# EAGLE design main (EAGLE 9.1.3)
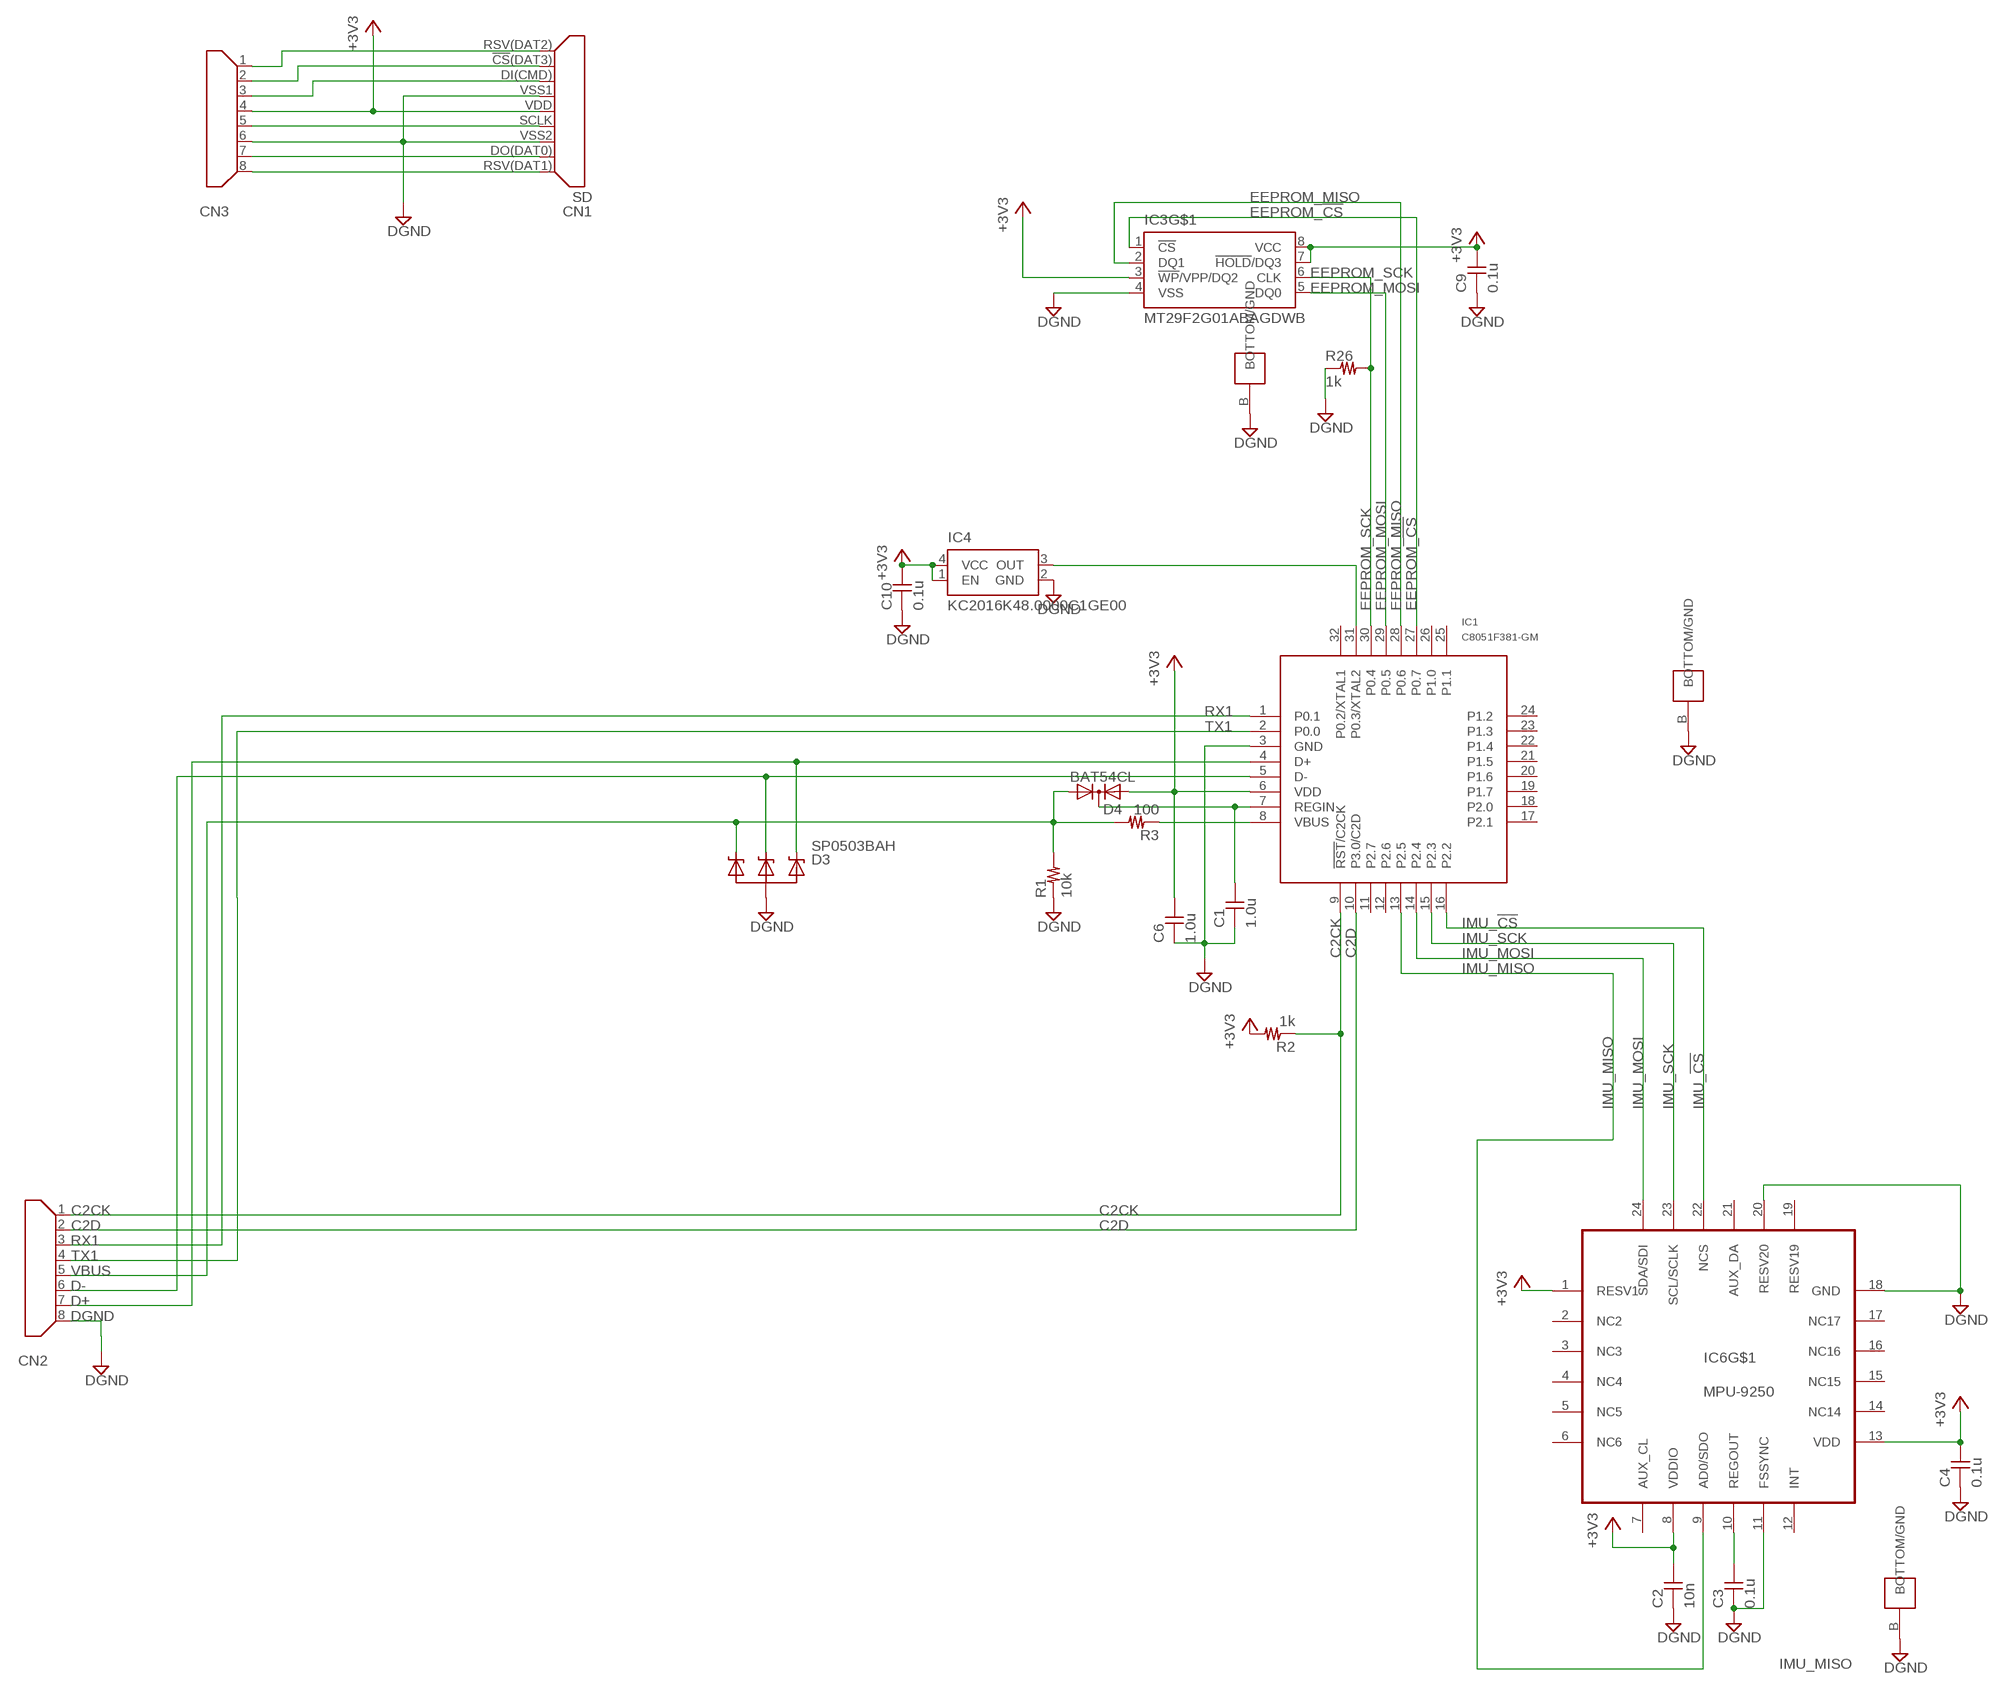
[diagram p0: schematic, sheet 1]

## Parts
C1  1.0u  C-1005  [1005]
C2  10n  C-1005  [1005]
C3  0.1u  C-1005  [1005]
C4  0.1u  C-1005  [1005]
C6  1.0u  C-1005  [1005]
C9  0.1u  C-1005  [1005]
C10  0.1u  C-1005  [1005]
CN1  SD  [SD_V3]
CN2  MICROSD  [BLOCK_SD_CONNECTOR]
CN3  MICROSD  [BLOCK_SD_CONNECTOR]
D3  SP0503BAH  [SOT143]
D4  BAT54CL  HSMS-2854  [SOT23]
IC1  C8051F381-GM  [QFN32]
IC3  MT29F2G01ABAGDWB  N25Q512A  [V-PDFN-8]
IC4  KC2016K48.0000C1GE00  KC2016K  [KC2016K]
IC6  MPU-9250  [QFN-24]
R1  10k  R-1005  [1005]
R2  1k  R-1005  [1005]
R3  100  R-1005  [1005]
R26  1k  R-1005  [1005]

## Nets
+3V3 [power]: C2.P$2 C4.P$2 C6.P$2 C9.P$2 C10.P$2 CN1.VDD CN3.4 D4.2(A2) IC1.6(VDD) IC3.3(!WP!/VPP/DQ2) IC3.7(!HOLD!/DQ3) IC3.8(VCC) IC4.1(EN) IC4.4(VCC) IC6.1(RESV1) IC6.8(VDDIO) IC6.13(VDD) R2.P$2
C2CK: CN2.1 IC1.9(!RST!/C2CK) R2.P$1
C2D: CN2.2 IC1.10(P3.0/C2D)
D+: CN2.7 D3.2 IC1.4(D+)
D-: CN2.6 D3.3 IC1.5(D-)
DGND [power]: C1.P$1 C2.P$1 C3.P$1 C4.P$1 C6.P$1 C9.P$1 C10.P$1 CN1.VSS1 CN1.VSS2 CN2.8 CN3.6 D3.1 IC1.3(GND) IC1.B(BOTTOM/GND) IC3.4(VSS) IC3.B(BOTTOM/GND) IC4.2(GND) IC6.11(FSSYNC) IC6.18(GND) IC6.20(RESV20) IC6.B(BOTTOM/GND) R1.P$1 R26.P$1
EEPROM_!CS: IC1.27(P0.7) IC3.1(!CS)
EEPROM_MISO: IC1.28(P0.6) IC3.2(DQ1)
EEPROM_MOSI: IC1.29(P0.5) IC3.5(DQ0)
EEPROM_SCK: IC1.30(P0.4) IC3.6(CLK) R26.P$2
IMU_!CS: IC1.16(P2.2) IC6.22(NCS)
IMU_MISO: IC1.13(P2.5) IC6.9(AD0/SDO)
IMU_MOSI: IC1.14(P2.4) IC6.24(SDA/SDI)
IMU_SCK: IC1.15(P2.3) IC6.23(SCL/SCLK)
N$1 [power]: C1.P$2 D4.3(C) IC1.7(REGIN)
N$2: CN1.RSV(DAT1) CN3.8
N$3: CN1.DO(DAT0) CN3.7
N$4: IC1.8(VBUS) R3.P$1
N$6: CN1.SCLK CN3.5
N$10: CN1.DI(CMD) CN3.3
N$11: IC1.31(P0.3/XTAL2) IC4.3(OUT)
N$12: CN1.!CS!(DAT3) CN3.2
N$13: C3.P$2 IC6.10(REGOUT)
N$14: CN1.RSV(DAT2) CN3.1
RX1: CN2.3 IC1.1(P0.1)
TX1: CN2.4 IC1.2(P0.0)
VBUS [power]: CN2.5 D3.4 D4.1(A1) R1.P$2 R3.P$2
Unconnected: IC1.11(P2.7) IC1.12(P2.6) IC1.17(P2.1) IC1.18(P2.0) IC1.19(P1.7) IC1.20(P1.6) IC1.21(P1.5) IC1.22(P1.4) IC1.23(P1.3) IC1.24(P1.2) IC1.25(P1.1) IC1.26(P1.0) IC1.32(P0.2/XTAL1) IC6.2(NC2) IC6.3(NC3) IC6.4(NC4) IC6.5(NC5) IC6.6(NC6) IC6.7(AUX_CL) IC6.12(INT) IC6.14(NC14) IC6.15(NC15) IC6.16(NC16) IC6.17(NC17) IC6.19(RESV19) IC6.21(AUX_DA)

## Library data of the parts
C1-C4 C6 C9 C10 = reg,cap:C-
CN1 = Connector:SD
CN2 CN3 = Connector:MICROSD
D3 = diode:SP0503BAH
D4 = avago:HSMS-2854: Surface Mount Microwave Schottky Detector Diodes Source: Data sheet <http://www.farnell.com/datasheets/461166.pdf>
IC1 = C8051F34x:C8051F381-GM
IC3 = EEPROM:N25Q512A
IC4 = Oscillator:KC2016K
IC6 = GYRO:MPU-9250
R1-R3 R26 = reg,cap:R-

## Net classes
0 signal: width 0.152 mm
1 power: width 0.203 mm

## Board
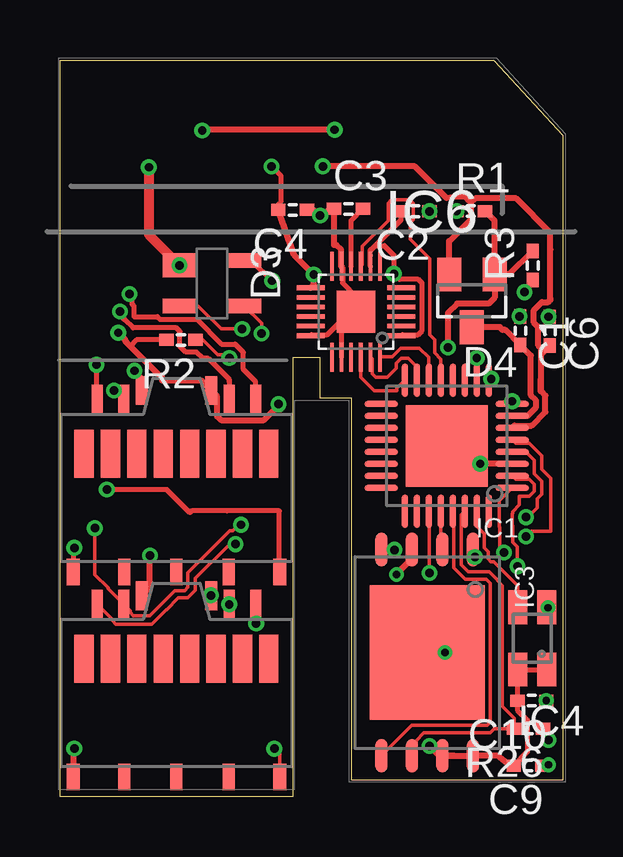
[diagram p1: board, top side]
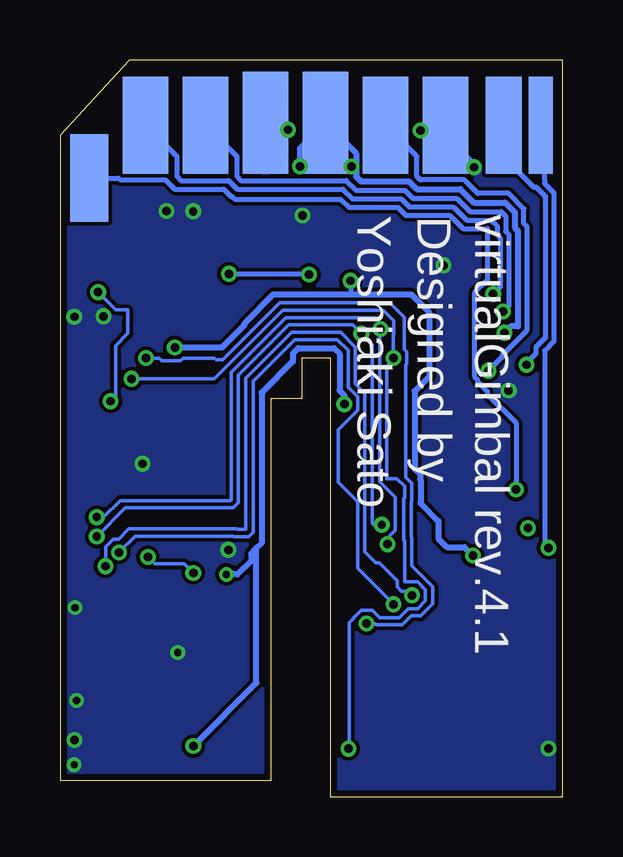
[diagram p2: board, bottom side, seen from below]

Size 20.95 x 30.7 mm. Coordinates in mm from the lower left corner, seen from the top.
Outline: 0,0 0,23.55 0,30.7 18.07,30.7 20.95,27.57 20.95,23.55 20.95,0.7 12.15,0.7 12.15,16.6 10.85,16.6 10.85,18.3 9.7,18.3 9.7,0 0,0
Copper layers (1*16): Top 0.035mm / dielectric 1.5mm / Bottom 0.035mm
Design rules "SeeedStudio_2layer_DRU_no_angle_20140221": minimum track width 6mil, minimum drill 12mil, track to track 6mil, track to pad 6mil, pad to pad 6mil, via to via 6mil, smd to smd 0mil, copper to edge 10mil, drill to drill 10mil, minimum pad ring 10mil, minimum via ring 6mil, stop-mask expansion 2mil, vias tented up to drill 100mil, thermal gap 10mil

### Footprints (pad centres in the part's own frame; a part is rotated, then mirrored left to right if it is on the bottom)
1005 = smd 0.6 x 0.5: P$1 -0.6,0; P$2 0.6,0
SD_V3 = smd 1.9 x 4.05: !CS!(DAT3) 2.5,2.2; DI(CMD) 5,2.2; SCLK 12.5,2.2; VSS2 15,2.2 | smd 1.5 x 4.05: DO(DAT0) 17.42,2.2 | smd 1 x 4.05: RSV(DAT1) 18.97,2.2 | smd 1.6 x 3.65: RSV(DAT2) 0.15,0 | smd 1.9 x 4.25: VDD 10,2.3; VSS1 7.5,2.3
BLOCK_SD_CONNECTOR = smd 0.55 x 1.1: 1 4.3,-0.43; 8 -4.3,-0.43 | smd 0.45 x 1.2: 2 3.3,6.77; 3 2.2,6.77; 6 -2.2,6.77; 7 -3.3,6.77 | smd 0.5 x 1.2: 4 1.45,7.13; 5 -1.45,7.13 | smd 0.5 x 1.1: 9 -2.18,-0.43; 10 0,-0.43; 11 2.18,-0.43 | smd 0.8 x 2: 12 -3.85,4.5; 13 -2.75,4.5; 14 -1.65,4.5; 15 -0.55,4.5; 16 0.55,4.5; 17 1.65,4.5; 18 2.75,4.5; 19 3.85,4.5
SOT143 = smd 1 x 1.4: 1 -0.75,-1.35 | smd 0.6 x 1.4: 2 0.95,-1.35; 3 0.95,1.35; 4 -0.95,1.35
SOT23 = smd 1 x 1.4: 1 -0.95,-1.1; 2 0.95,-1.1; 3 0,1.1
QFN32 = smd 1.4 x 0.25: 1 -2.725,1.75; 2 -2.725,1.25; 3 -2.725,0.75; 4 -2.725,0.25; 5 -2.725,-0.25; 6 -2.725,-0.75; 7 -2.725,-1.25; 8 -2.725,-1.75; 17 2.725,-1.75; 18 2.725,-1.25; 19 2.725,-0.75; 20 2.725,-0.25; 21 2.725,0.25; 22 2.725,0.75; 23 2.725,1.25; 24 2.725,1.75 | smd 0.25 x 1.4: 9 -1.75,-2.725; 10 -1.25,-2.725; 11 -0.75,-2.725; 12 -0.25,-2.725; 13 0.25,-2.725; 14 0.75,-2.725; 15 1.25,-2.725; 16 1.75,-2.725; 25 1.75,2.725; 26 1.25,2.725; 27 0.75,2.725; 28 0.25,2.725; 29 -0.25,2.725; 30 -0.75,2.725; 31 -1.25,2.725; 32 -1.75,2.725 | smd 3.4 x 3.4: B 0,0
V-PDFN-8 = smd 1.4 x 0.5: 1 -4.3,1.905; 2 -4.3,0.635; 3 -4.3,-0.635; 4 -4.3,-1.905; 5 4.3,-1.905; 6 4.3,-0.635; 7 4.3,0.635; 8 4.3,1.905 | smd 5.6 x 4.8: B 0,0
KC2016K = smd 1.4 x 0.8: 1 -1.3,-0.6; 2 1.3,-0.6; 3 1.3,0.6; 4 -1.3,0.6
QFN-24 = smd 1.22 x 0.2: 1 -1.89,1; 2 -1.89,0.6; 3 -1.89,0.2; 4 -1.89,-0.2; 5 -1.89,-0.6; 6 -1.89,-1; 13 1.89,-1; 14 1.89,-0.6; 15 1.89,-0.2; 16 1.89,0.2; 17 1.89,0.6; 18 1.89,1 | smd 0.2 x 1.22: 7 -1,-1.89; 8 -0.6,-1.89; 9 -0.2,-1.89; 10 0.2,-1.89; 11 0.6,-1.89; 12 1,-1.89; 19 1,1.89; 20 0.6,1.89; 21 0.2,1.89; 22 -0.2,1.89; 23 -0.6,1.89; 24 -1,1.89 | smd 1.59 x 1.75: B 0,0

### Placement (x,y rotation side)
C1  19.18,19.42 270 top
C2  14.8,24.39 180 top
C3  12.02,24.5 0 top
C4  9.69,24.46 180 top
C6  20.41,19.4 270 top
C9  19.5,1.3 180 top
C10  19.66,4.01 180 top
CN1  19.88,25.78 0 bottom
CN2  4.85,1.25 0 top
CN3  4.85,9.8 0 top
D3  6.33,21.39 270 top
D4  17.16,20.66 180 top
IC1  16.11,14.62 180 top
IC3  15.3,6 270 top
IC4  19.68,6.6 90 top
IC6  12.33,20.21 180 top
R1  17.11,24.41 0 top
R2  5.04,19.04 180 top
R3  19.7,22.14 90 top
R26  19.52,2.84 180 top

### Tracks (layer width: path | path; a pad name or v marks a point on that pad's centre or on a via)
+3V3  (via drill 0.3, 0.35)
  Top 0.203: IC3.3 14.72,10.36 | 19.47,1.87 19.47,3.2 19.06,3.61 C10.P$2 19.06,5.29 IC4.4 IC4.1 | 19.47,1.87 18.84,1.24 | C9.P$2 19.47,1.87 | IC6.8 12.93,22.8 | C4.P$2 9.09,24.69 9.21,24.8 9.21,25.86 v8.81,26.26 | IC6.1 14.27,19.26 14.92,19.26 15.08,19.42 15.08,21.4 14.92,21.56 14.14,21.56 v13.91,21.79 13.91,22.3 13.91,22.57 13.52,22.96 13.14,22.96 12.97,22.8 | 12.93,22.55 12.93,22.8 | 12.93,22.8 12.97,22.8 | 12.97,22.8 14.2,24.03 C2.P$2 | 16.1,24.95 16.24,24.95 16.27,24.99 16.88,24.99 17.01,24.86 17.12,24.74 | R2.P$2 3.19,19.04 2.93,18.78
  Top 0.254: IC3.7 16.45,1.71 | 16.45,1.71 IC3.8 18.24,1.71 18.84,1.24 | C4.P$2 9.77,22.57 v10.57,21.76 10.57,21.35 IC6.13 | v2.43,19.34 2.74,19.02 2.74,18.97 2.93,18.78 4.15,17.56 4.2,17.56 4.24,17.52 4.24,17.35 5.88,17.35 CN3.4 6.55,16.68 6.55,15.85 6.71,15.69 8.49,15.69 8.95,16.15 9.21,16.15 9.21,16.25 v9.1,16.36 | 19.07,4.01 C10.P$2 | 16.45,1.71 15.8,1.71 v15.39,2.11 | IC3.3 14.66,9.91 v14.02,9.27 | 20.04,16.89 20.23,16.71 20.23,16.04 19.65,15.47 18.93,15.47 IC1.6 | 20.04,16.89 20.03,16.91 20.03,17.39 | C6.P$2 20.04,18.43 | 20.04,16.89 20.04,18.3 | 20.04,18.3 20.04,18.43 | D4.2 16.21,23.16 17.12,24.07 17.12,24.74 | v10.95,26.27 14.78,26.27 16.1,24.95 | 17.01,24.86 17.22,24.86 17.3,24.93 19.01,24.93 20.43,23.5 20.43,22.8 20.43,20.76 20.43,20.7 20.34,20.61 20.08,20.61 19.75,20.28 19.75,19.75 19.89,19.61 19.89,19.59 19.93,19.54 19.93,18.8 20.04,18.69 20.04,18.3 | 20.04,18.3 | 20.04,18.3 20.04,18.43
  Bottom 0.203: v8.81,26.26 8.62,26.26 8.61,26.25 | v13.91,21.79 10.6,21.79 v10.57,21.76
  Bottom 0.254: v14.02,9.27 13.55,9.27 12.99,9.83 12.99,10.12 12.77,10.35 | v2.43,19.34 2.16,19.6 1.87,19.6 1.87,23.59 2,23.71 2,24.35 2.41,24.76 3.7,24.76 4.26,25.32 6.09,25.32 6.42,25.65 8.42,25.65 8.61,25.84 8.61,26.25 8.61,26.81 CN1.VDD 10.95,27.01 v10.95,26.27 | v15.39,2.11 12.77,4.74 12.77,10.35 | 12.77,10.35 12.55,10.57 12.55,16.84 11.25,18.14 11.25,18.46 11.01,18.7 9.54,18.7 9.3,18.46 9.3,16.93 9.1,16.73 v9.1,16.36
C2CK  (via drill 0.35)
  Top 0.152: IC1.9 17.9,17.35 v17.97,17.41 | v8.93,2 9.15,1.79 CN2.1 | R2.P$1 5.95,19.04 6.57,18.42 6.92,18.42 v7.06,18.28
  Bottom 0.152: v17.97,17.41 14.52,17.41 11.67,20.27 7.48,20.27 7.04,19.83 7.04,19.27 7.06,19.24 v7.06,18.28 7.06,18.22 7.33,17.95 7.33,13.26 6.92,13.26 6.59,12.93 6.59,12.47 6.62,12.44 6.62,10.69 6.59,10.67 6.59,8.95 6.05,8.95 5.73,8.63 5.73,8.17 6.05,7.84 6.44,7.84 6.82,7.46 7.64,7.46 7.94,7.77 8.4,7.77 8.73,7.44 8.73,7.42 8.9,7.25 8.9,2.03 v8.93,2
C2D  (via drill 0.35)
  Top 0.152: IC1.10 v17.36,18.28 | v8.17,7.21 8.17,8 CN2.2
  Bottom 0.152: v8.17,7.21 7.82,7.21 7.76,7.16 6.69,7.16 6.32,7.54 5.93,7.54 5.42,8.04 5.42,8.75 6.29,9.62 6.29,10.79 6.32,10.82 6.32,12.31 6.28,12.34 6.28,13.06 6.54,13.32 6.54,18 6.5,18.05 6.5,18.54 6.62,18.66 6.62,19.98 7.21,20.58 11.79,20.58 14.16,18.21 14.44,18.21 14.52,18.28 15.82,18.28 15.93,18.17 16.7,18.17 16.81,18.28 v17.36,18.28
D+  (via drill 0.35)
  Top 0.152: v19.42,11.65 19.5,11.65 19.88,12.04 19.88,12.41 20.07,12.6 20.07,13.15 19.77,13.45 19.77,14.02 19.45,14.35 18.87,14.35 IC1.4 | CN2.7 2.2,7.37 2.2,7.33 2.33,7.19 3.82,7.19 4.42,7.8 4.45,7.8 4.94,8.29 5.32,8.29 5.63,8.6 5.63,9.1 7.06,10.53 v7.31,10.53 | v7.59,19.5 6.72,19.5 5.77,20.45 D3.2
  Bottom 0.152: v19.42,11.65 19.14,11.65 18.45,12.34 13.86,12.34 13.82,12.38 13.82,17.69 11.54,19.97 7.84,19.97 7.62,19.75 7.63,19.73 7.63,19.3 | v7.31,10.53 7.31,10.78 6.99,11.1 6.99,12.49 7.63,13.13 7.63,19.3 | 7.63,19.3 | 7.63,19.3 7.59,19.34 v7.59,19.5
D-  (via drill 0.35)
  Top 0.152: IC1.5 18.99,14.73 19.56,14.73 20.07,14.22 20.07,13.64 20.45,13.27 20.45,11.07 19.95,11.07 19.64,11.07 v19.42,10.85 | v7.54,11.33 7.45,11.33 7.2,11.08 7.08,11.08 6.87,10.88 5.33,9.33 5.33,8.73 5.2,8.59 4.79,8.59 3.75,7.55 3.06,7.55 2.92,7.68 2.92,7.75 CN2.6 2,8.67 2,8.71 1.46,9.26 1.46,10.73 1.45,10.74 v1.45,11.19 | D3.3 8.4,19.72 v8.4,19.3
  Bottom 0.152: v19.42,10.85 18.23,12.04 13.73,12.04 13.51,12.25 13.51,17.56 11.41,19.66 8.76,19.66 v8.4,19.3 7.94,18.84 7.94,18.3 | 7.94,18.3 7.94,17.8 7.94,11.4 7.87,11.33 v7.54,11.33 | 7.94,18.3
DGND  (via drill 0.3, 0.35)
  Top 0.203: IC6.20 11.73,19.61 12.18,20.07 | 12.18,20.07 IC6.B 12.33,20.85 11.77,21.4 11.77,22.06 IC6.11 | IC6.18 10.49,19.26 11.14,19.26 11.95,20.07 12.18,20.07 | C4.P$1 10.6,24.46 v10.84,24.22 10.92,24.22 11.2,24.5 C3.P$1 | C1.P$1 v19.14,20.02
  Top 0.254: C3.P$1 11.42,22.99 11.53,22.99 11.71,22.81 11.71,22.12 IC6.11 | IC1.3 v17.51,13.88 16.76,14.62 | v0.6,2.02 0.55,1.97 CN2.8 | CN3.6 2.3,16.93 v2.26,16.93 | v11.44,27.8 5.96,27.8 v5.92,27.76 | 20.31,1.29 C9.P$1 20.32,1.3 v20.36,1.33 | R26.P$1 20.12,2.59 v20.35,2.36 | IC3.4 13.92,10.31 v13.93,10.29 | IC3.B v16.04,6.01 | C6.P$1 v20.35,20 | IC4.2 20.31,7.9 v20.33,7.88
  Top 0.305: IC1.B 16.76,14.62
  Top 0.406: v3.7,26.23 3.7,23.42 D3.1
  Bottom 0.254: CN1.VSS2 4.99,28.09 5.32,27.76 v5.92,27.76 | CN1.VSS1 12.09,27.8 v11.44,27.8
  Bottom 0.406: CN1.VSS2 4.88,27.41 v3.7,26.23
  other vias: 20.26,4.01 15.4,24.39 16.52,24.41 4.98,22.14
  pour Bottom: -0.55,-0.7 22.45,-0.7 22.45,26.3 -0.55,26.3
EEPROM_!CS  (via drill 0.35)
  Top 0.152: v17.29,9.99 17.29,10.23 IC3.1 | IC1.27 15.36,11.57 15.39,11.54 v15.39,9.33
  Bottom 0.152: v15.39,9.33 15.77,9.71 17,9.71 v17.29,9.99
EEPROM_MISO
  Top 0.152: IC1.28 15.86,10.38 IC3.2
EEPROM_MOSI
  Top 0.152: IC3.5 14.67,2.98 17.79,2.98 17.93,3.11 17.93,8.9 17.76,9.07 16.88,9.07 16.41,9.54 16.41,11.9 IC1.29
EEPROM_SCK
  Top 0.152: 18.43,8.57 18.43,3.77 18.92,3.28 R26.P$2 18.09,2.84 17.92,2.67 15.63,2.67 15.16,2.67 14.84,2.34 14.84,1.88 IC3.6 | 18.43,8.57 18.43,8.8 | 18.43,8.57 18.43,8.8 | 18.43,8.8 18.23,9 18.23,9.03 17.88,9.38 17.01,9.38 16.72,9.67 16.72,11.75 IC1.30
IMU_!CS
  Top 0.152: IC6.22 12.53,17.48 13.1,16.91 13.95,16.91 | 13.95,16.91 14.04,16.91 14.04,17.02 IC1.16 | 13.95,16.91
IMU_MISO
  Top 0.152: IC6.9 12.6,22.17 12.6,22.94 13.67,24.01 13.67,24.74 13.8,24.87 14.59,24.87 14.73,24.74 14.73,24.05 14.59,23.92 14.59,23.24 15.41,22.42 15.41,19.25 15.62,19.05 15.62,18.96 15.61,18.96 15.61,18.5 15.86,18.24 IC1.13
IMU_MOSI
  Top 0.152: IC1.14 15.36,18.31 14.98,18.7 14.2,18.7 13.84,18.34 13.35,18.34 IC6.24
IMU_SCK
  Top 0.152: IC1.15 14.86,17.93 14.51,18.28 14.44,18.28 14.22,18.28 14.01,18.07 14.01,17.86 13.63,17.48 13.45,17.48 13.15,17.48 13,17.63 13,18.25 IC6.23
N$1
  Top 0.203: IC1.7
  Top 0.254: 19.82,16.21 19.82,16.54 19.62,16.74 19.62,18.38 C1.P$2 18.55,19.46 18.43,19.46 18.32,19.57 D4.3 | 19.82,16.21 | 19.82,16.21 19.48,15.87 IC1.7
N$2  (via drill 0.35)
  Top 0.203: v0.6,10.38 0.55,10.33 CN3.8
  Bottom 0.203: v0.6,10.38 0.76,10.54 0.76,18.59 0.37,18.98 0.37,25.16 0.76,25.55 CN1.RSV(DAT1)
N$3  (via drill 0.35)
  Top 0.203: v1.51,18 1.51,16.61 CN3.7
  Bottom 0.203: CN1.DO(DAT0) 2.46,26.1 2.42,26.06 1.87,26.06 1.22,25.4 1.11,25.4 0.73,25.02 0.73,19.13 1.12,18.73 1.12,18.46 1.51,18.07 v1.51,18
N$4  (via drill 0.35)
  Top 0.152: v18.84,16.48 IC1.8 | R3.P$1 19.36,21.21 v19.36,21.03
  Bottom 0.152: v18.84,16.48 18.63,16.69 18.63,18.8 18.12,19.31 18.12,19.82 18.13,19.83 18.13,20.29 18.63,20.29 18.91,20.58 v19.36,21.03
N$6  (via drill 0.35)
  Top 0.2: v3.1,17.75 3.44,17.41 3.44,16.96
  Top 0.254: 3.44,16.96 CN3.5
  Bottom 0.203: CN1.SCLK 6.08,26.68 6.08,25.85 5.94,25.7 4.11,25.7 3.55,25.14 2.25,25.14 1.62,24.51 1.62,23.87 1.49,23.74 1.49,19.44 2.5,18.43 2.5,18.35 v3.1,17.75
N$10  (via drill 0.35)
  Top 0.2: 7.04,17.39 6.17,18.27 5.95,18.27 5.69,18.53 5.24,18.53 5,18.78 5,19.39 4.85,19.54 3.04,19.54 2.7,19.88
  Top 0.203: CN3.3 7.05,17.3 7.04,17.3 7.04,17.39 | v2.5,20.21 2.59,20.12 2.59,19.99 2.7,19.88
  Bottom 0.203: CN1.DI(CMD) 13.58,26.68 13.58,25.85 13.41,25.68 9.02,25.68 8.61,25.27 6.58,25.27 6.25,24.94 4.42,24.94 3.86,24.38 2.57,24.38 2.38,24.2 2.38,23.56 2.25,23.43 2.25,20.46 v2.5,20.21
N$11
  Top 0.152: IC4.3 19.07,8.8 18.07,9.8 17.95,9.8 17.84,9.91 17.84,10.22 17.68,10.38 17.68,10.95 17.36,11.27 IC1.31
N$12  (via drill 0.35)
  Top 0.2: 3.08,20.01 4.05,20.01 4.17,19.89 5.69,19.89
  Top 0.203: CN3.2 8.15,17.3 7.64,17.81 7.64,18.52 7.3,18.86 6.72,18.86 5.69,19.89 | v2.9,20.95 3,20.85 3,20.53 3.08,20.46 3.08,20.01
  Bottom 0.203: CN1.!CS!(DAT3) 16.08,26.68 16.08,25.85 15.91,25.68 13.93,25.68 13.57,25.32 9.16,25.32 8.76,24.91 6.73,24.91 6.4,24.58 4.57,24.58 4.01,24.03 2.97,24.03 2.74,23.79 2.74,23.41 2.61,23.28 2.61,21.25 v2.9,20.95
N$13
  Top 0.203: IC6.10 12.13,24 C3.P$2
N$14  (via drill 0.35)
  Top 0.2: 6.95,11.92 5.48,11.92 5.41,11.84 4.45,12.8 v1.95,12.8
  Top 0.203: CN3.1 9.15,11.92 6.95,11.92
  Bottom 0.2: 3.68,20.99 3.68,17.51 3.56,17.39 3.56,17.3 3.14,16.88 3.14,16.77
  Bottom 0.203: CN1.RSV(DAT2) 18.51,25.78 18.43,25.7 16.55,25.7 16.17,25.32 14.13,25.32 13.82,25.01 13.76,25.01 13.65,24.89 9.24,24.89 8.9,24.55 6.87,24.55 6.54,24.23 4.72,24.23 4.16,23.67 3.14,23.67 3.14,21.53 3.68,20.99 | v1.95,12.8 1.95,15.58 3.14,16.77
RX1  (via drill 0.35)
  Top 0.152: IC1.1 18.3,12.34 18.3,12.3 18.3,11.24 18.31,11.23 18.31,10.88 18.31,10.37 v18.5,10.19
  Bottom 0.152: CN2.3 8.55,9.52 8.55,12.3 9.35,13.11 9.35,15.3 8.55,16.11 8.55,16.67 8.95,17.07 8.95,18.61 9.39,19.05 11.16,19.05 12.9,17.31 12.9,11.02 13.08,10.84 13.69,10.84 13.72,10.87 17.81,10.87 v18.5,10.19
  other vias: 7.05,8.02
TX1  (via drill 0.35)
  Top 0.152: IC1.2 18.99,13.23 19.56,13.23 19.77,13.02 19.77,12.73 19.56,12.52 19.14,12.52 19.14,12.16 18.86,11.88 18.86,11.82 18.84,11.8 | 18.84,11.8 18.84,11.49 | v19.06,9.61 v19.05,9.61 19.05,10.42 18.86,10.61 18.86,11.3 18.84,11.32 18.84,11.8
  Top 0.2: CN2.4 v6.28,8.4
  Bottom 0.152: v19.06,9.61 v19.05,9.61 19.05,10.42 18.72,10.74 18.51,10.74 18.08,11.17 13.6,11.17 13.57,11.14 13.21,11.14 13.21,11.55 13.21,17.44 11.29,19.36 9.26,19.36 | 8.64,18.74 9.26,19.36 | 8.64,18.74 9.26,19.36 | 8.64,18.74 8.64,17.2 8.24,16.8 8.24,10.21 7.79,9.76 7.65,9.76 6.9,9.01 6.9,8.75 6.72,8.57 6.46,8.57 v6.28,8.4
VBUS  (via drill 0.35)
  Top 0.203: D3.4 8,22.35 v8.84,21.5
  Top 0.254: CN2.5 3.75,8.73 v3.75,10.05 | D4.1 18.11,20.8 17.85,20.54 16.54,20.54 16.16,20.16 v16.16,18.73 | D4.1 18.11,24.01 R1.P$2 | R3.P$2 18.72,21.77 D4.1
  Bottom 0.203: v8.84,21.5 8.84,21 8.91,20.94
  Bottom 0.254: v3.75,10.05 4.1,10.4 4.83,10.4 5.18,10.76 5.18,11.49 5.93,12.23 5.93,13.2 5.95,13.23 5.95,13.43 6.17,13.65 6.17,16.91 5.57,17.5 5.57,20.19 6.32,20.94 8.91,20.94 12.05,20.94 13.26,19.73 13.26,19.66 14.2,18.73 v16.16,18.73

### Text on the board
bNames: virtualGimbal rev.4.1 | Designed by | Yoshiaki Sato